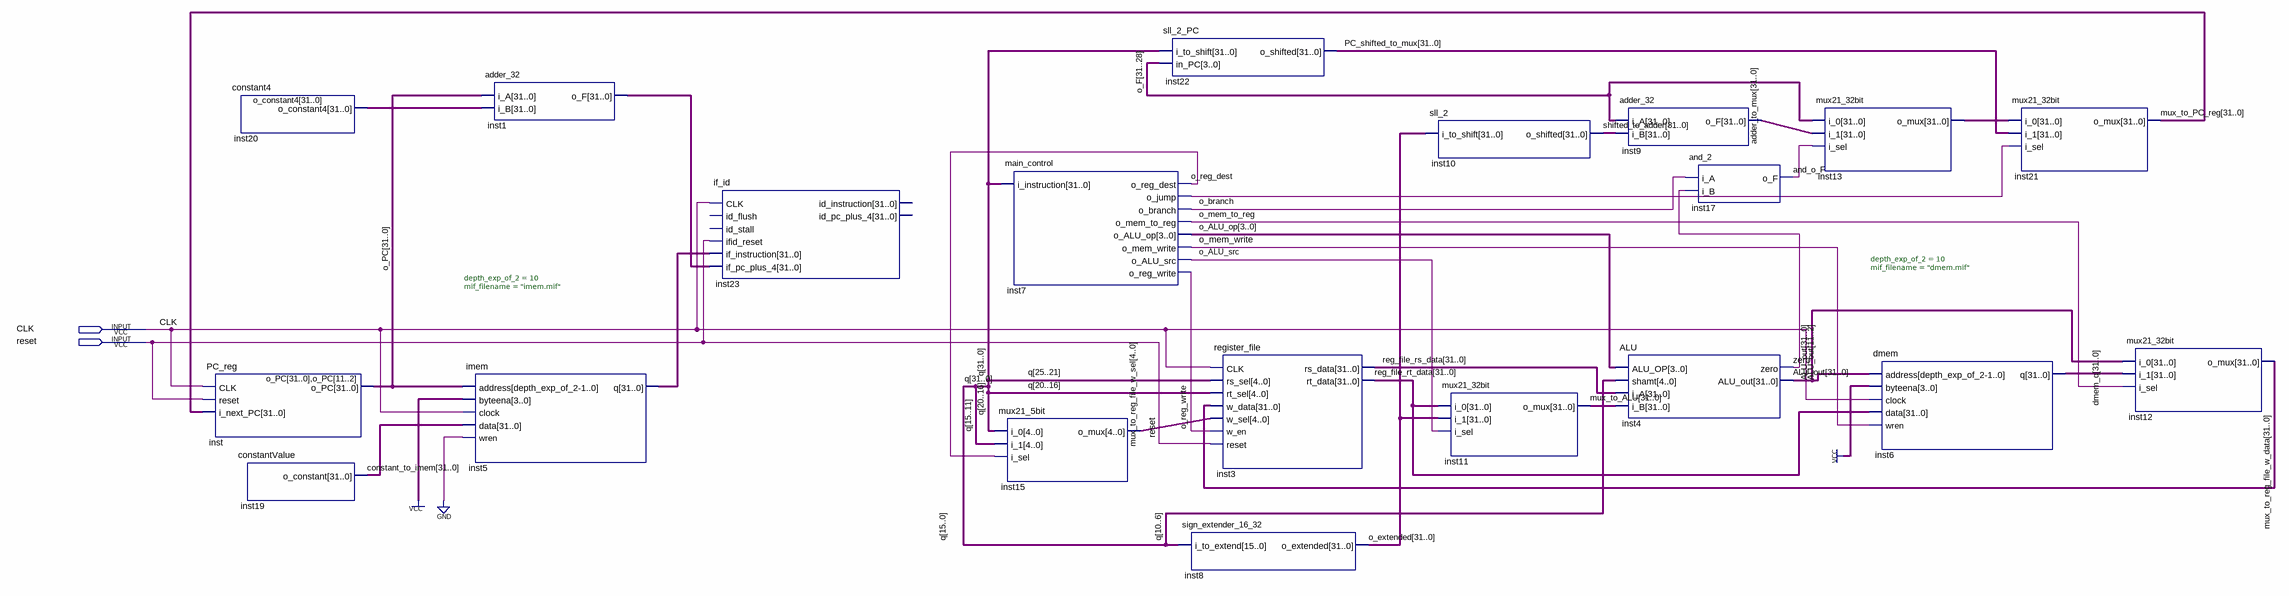
[diagram p0: schematic sheet]
// Quartus schematic projectB.bdf as structural Verilog: 20 symbols, 2 pins
module projectB (
  input  CLK,
  input  reset
);

  wire and_o_F, inst7_o_jump, o_ALU_src, o_branch, o_mem_to_reg, o_mem_write, o_reg_dest, o_reg_write, zero;
  wire [3:0] o_ALU_op;
  wire [4:0] mux_to_reg_file_w_sel;
  wire [31:0] adder_to_mux, ALU_out, constant_to_imem, dmem_q, inst1_o_f, inst5_q, inst13_o_mux, mux_to_ALU,
       mux_to_PC_reg, mux_to_reg_file_w_data, o_constant4, o_extended, o_PC, PC_shifted_to_mux, q,
       reg_file_rs_data, reg_file_rt_data, shifted_to_adder;
  wire [31:28] o_F;

  constant4 inst20 (.o_constant4(o_constant4));
  PC_reg inst (.CLK(CLK), .reset(reset), .i_next_PC(mux_to_PC_reg), .o_PC({o_PC, o_PC[11:2]}));
  constantValue inst19 (.o_constant(constant_to_imem));
  adder_32 inst1 (.i_A(o_PC), .i_B(o_constant4), .o_F(inst1_o_f));
  imem #(.depth_exp_of_2(10), .mif_filename("imem.mif")) inst5 (
    .address({o_PC, o_PC[11:2]}), .byteena(4'b1111), .clock(CLK), .data(constant_to_imem), .wren(1'b0),
    .q(inst5_q));
  if_id inst23 (
    .CLK(CLK), .ifid_reset(reset), .if_instruction(inst5_q), .if_pc_plus_4(inst1_o_f));  // open: id_flush, id_stall, id_instruction, id_pc_plus_4
  main_control inst7 (
    .i_instruction(q), .o_reg_dest(o_reg_dest), .o_jump(inst7_o_jump), .o_branch(o_branch),
    .o_mem_to_reg(o_mem_to_reg), .o_ALU_op(o_ALU_op), .o_mem_write(o_mem_write), .o_ALU_src(o_ALU_src),
    .o_reg_write(o_reg_write));
  mux21_5bit inst15 (.i_0(q[20:16]), .i_1(q[15:11]), .i_sel(o_reg_dest), .o_mux(mux_to_reg_file_w_sel));
  sll_2_PC inst22 (.i_to_shift(q), .in_PC(o_F), .o_shifted(PC_shifted_to_mux));
  sign_extender_16_32 inst8 (.i_to_extend(q[15:0]), .o_extended(o_extended));
  register_file inst3 (
    .CLK(CLK), .rs_sel(q[25:21]), .rt_sel(q[20:16]), .w_data(mux_to_reg_file_w_data),
    .w_sel(mux_to_reg_file_w_sel), .w_en(o_reg_write), .reset(reset), .rs_data(reg_file_rs_data),
    .rt_data(reg_file_rt_data));
  sll_2 inst10 (.i_to_shift(o_extended), .o_shifted(shifted_to_adder));
  mux21_32bit inst11 (.i_0(reg_file_rt_data), .i_1(o_extended), .i_sel(o_ALU_src), .o_mux(mux_to_ALU));
  adder_32 inst9 (.i_A(o_F), .i_B(shifted_to_adder), .o_F(adder_to_mux));
  ALU inst4 (
    .ALU_OP(o_ALU_op), .shamt(q[10:6]), .i_A(reg_file_rs_data), .i_B(mux_to_ALU), .zero(zero),
    .ALU_out(ALU_out));
  and_2 inst17 (.i_A(o_branch), .i_B(zero), .o_F(and_o_F));
  mux21_32bit inst13 (.i_0(o_F), .i_1(adder_to_mux), .i_sel(and_o_F), .o_mux(inst13_o_mux));
  dmem #(.depth_exp_of_2(10), .mif_filename("dmem.mif")) inst6 (
    .address(ALU_out[11:2]), .byteena(4'b1111), .clock(CLK), .data(reg_file_rt_data), .wren(o_mem_write),
    .q(dmem_q));
  mux21_32bit inst21 (.i_0(inst13_o_mux), .i_1(PC_shifted_to_mux), .i_sel(inst7_o_jump), .o_mux(mux_to_PC_reg));
  mux21_32bit inst12 (.i_0(ALU_out), .i_1(dmem_q), .i_sel(o_mem_to_reg), .o_mux(mux_to_reg_file_w_data));
endmodule
